# EAGLE schematic Prototype (EAGLE 7.5.0)
DESIGNER: Adam Green
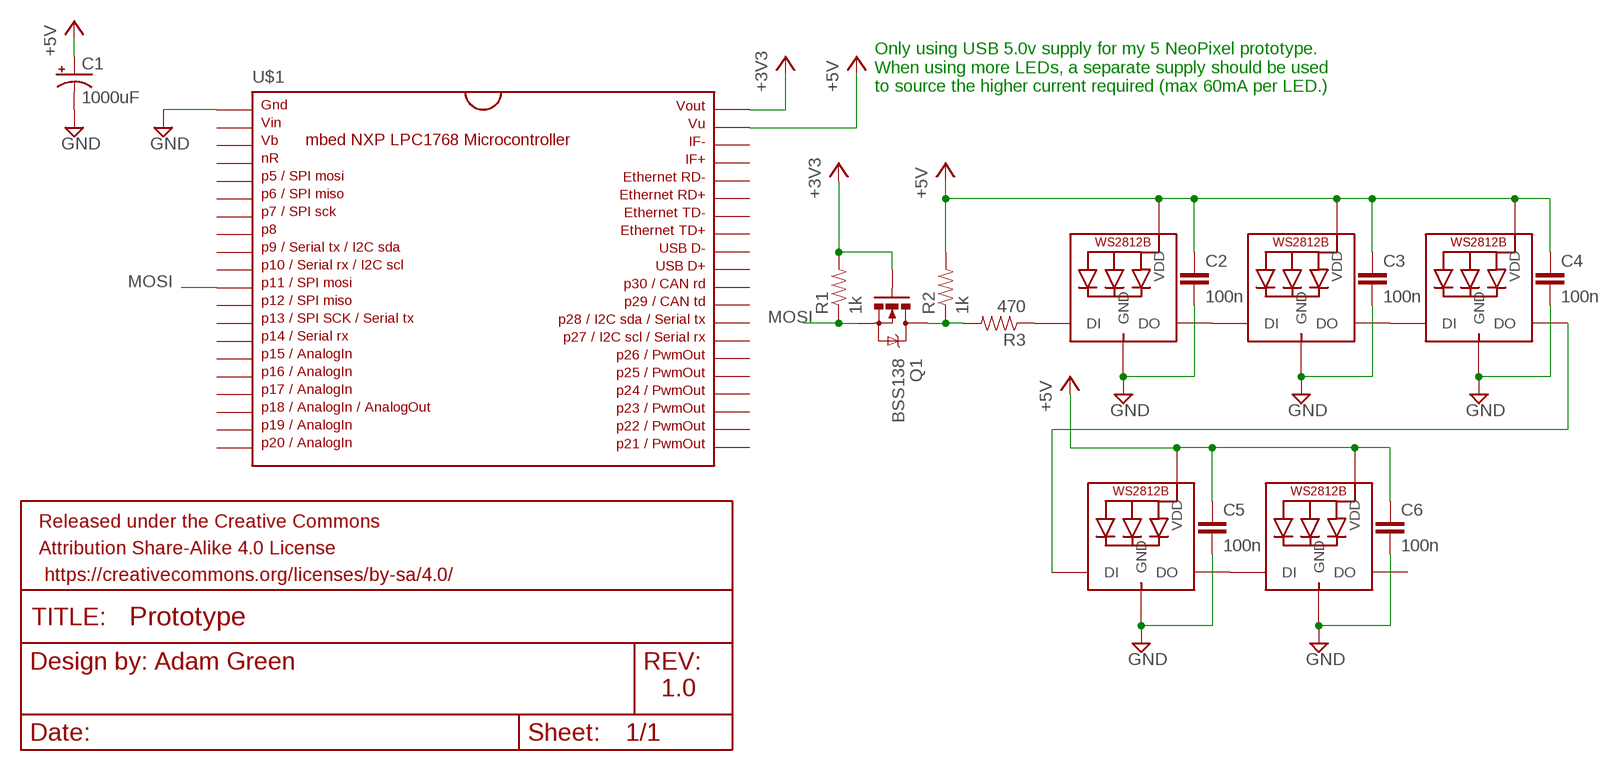
[diagram p0: schematic, sheet 1]

## Parts
C1  1000uF  CAP_POLPTH4  [CPOL-RADIAL-1000UF-25V]
C2  100n  CAP0805  [0805]
C3  100n  CAP0805  [0805]
C4  100n  CAP0805  [0805]
C5  100n  CAP0805  [0805]
C6  100n  CAP0805  [0805]
LED1  WS2812B3535  [LED3535]
LED2  WS2812B3535  [LED3535]
LED4  WS2812B3535  [LED3535]
LED5  WS2812B3535  [LED3535]
LED6  WS2812B3535  [LED3535]
Q1  BSS138  MOSFET-NCHANNELBSS138  [SOT23-3]
R1  1k  RESISTOR0805-RES  [0805]
R2  1k  RESISTOR0805-RES  [0805]
R3  470  RESISTOR0805-RES  [0805]
U$1  MBED_NXP_LPC1768  [DIL40_0.9]

## Nets
+3V3: Q1.1(G) R1.2 U$1.40
+5V: C1.1(+) C2.1 C3.1 C4.1 C5.1 C6.1 LED1.2(VDD) LED2.2(VDD) LED4.2(VDD) LED5.2(VDD) LED6.2(VDD) R2.2 U$1.39
GND: C1.2(-) C2.2 C3.2 C4.2 C5.2 C6.2 LED1.4(GND) LED2.4(GND) LED4.4(GND) LED5.4(GND) LED6.4(GND) U$1.1
MOSI: Q1.2(S) R1.1 U$1.11
N$1: LED1.3(DO) LED2.1(DI)
N$2: Q1.3(D) R2.1 R3.2
N$3: LED2.3(DO) LED4.1(DI)
N$4: LED1.1(DI) R3.1
N$5: LED5.3(DO) LED6.1(DI)
N$7: LED4.3(DO) LED5.1(DI)
Unconnected: LED6.3(DO) U$1.2 U$1.3 U$1.4 U$1.5 U$1.6 U$1.7 U$1.8 U$1.9 U$1.10 U$1.12 U$1.13 U$1.14 U$1.15 U$1.16 U$1.17 U$1.18 U$1.19 U$1.20 U$1.21 U$1.22 U$1.23 U$1.24 U$1.25 U$1.26 U$1.27 U$1.28 U$1.29 U$1.30 U$1.31 U$1.32 U$1.33 U$1.34 U$1.35 U$1.36 U$1.37 U$1.38

## Notes on the sheet
- Only using USB 5.0v supply for my 5 NeoPixel prototype.
  When using more LEDs, a separate supply should be used 
  to source the higher current required (max 60mA per LED.)
- 1.0

## Library data of the parts
C1 = SparkFun-Passives:CAP_POL: Capacitor Polarized These are standard SMD and PTH capacitors. Normally 10uF, 47uF, and 100uF in electrolytic and tantalum varieties. Always verify the external diameter of the through hole cap, it varies with capacity, voltage, and manufacturer. The EIA devices should be standard.
C2-C6 = SparkFun-Passives:CAP: Capacitor Standard 0603 ceramic capacitor, and 0.1" leaded capacitor.
LED1 LED2 LED4-LED6 = adafruit:WS2812B
Q1 = SparkFun-DiscreteSemi:MOSFET-NCHANNEL: Common NMOSFET Parts MFG P/N Store ID Prod ID FDD8780 TRANS-09984 SI7820DN TRANS-11055 FDS6630A IC-08089 2N7002PW TRANS-11151 FQP30N06L COM-10213 TRANS-10060 BSS123LT1G TRANS-08345 BSS138 TRANS-00830 BS170 2N7000; PROD_ID: TRANS-00830; VALUE: 200mA/50V
R1-R3 = SparkFun-Resistors:RESISTOR: Resistor Basic schematic elements and footprints for 0603, 1206, and PTH resistors.
U$1 = SparkFun-DigitalIC:MBED_NXP_LPC1768